# EAGLE design 7segement4digits1badidea-mk-5.0-smd (EAGLE 6.5.0)
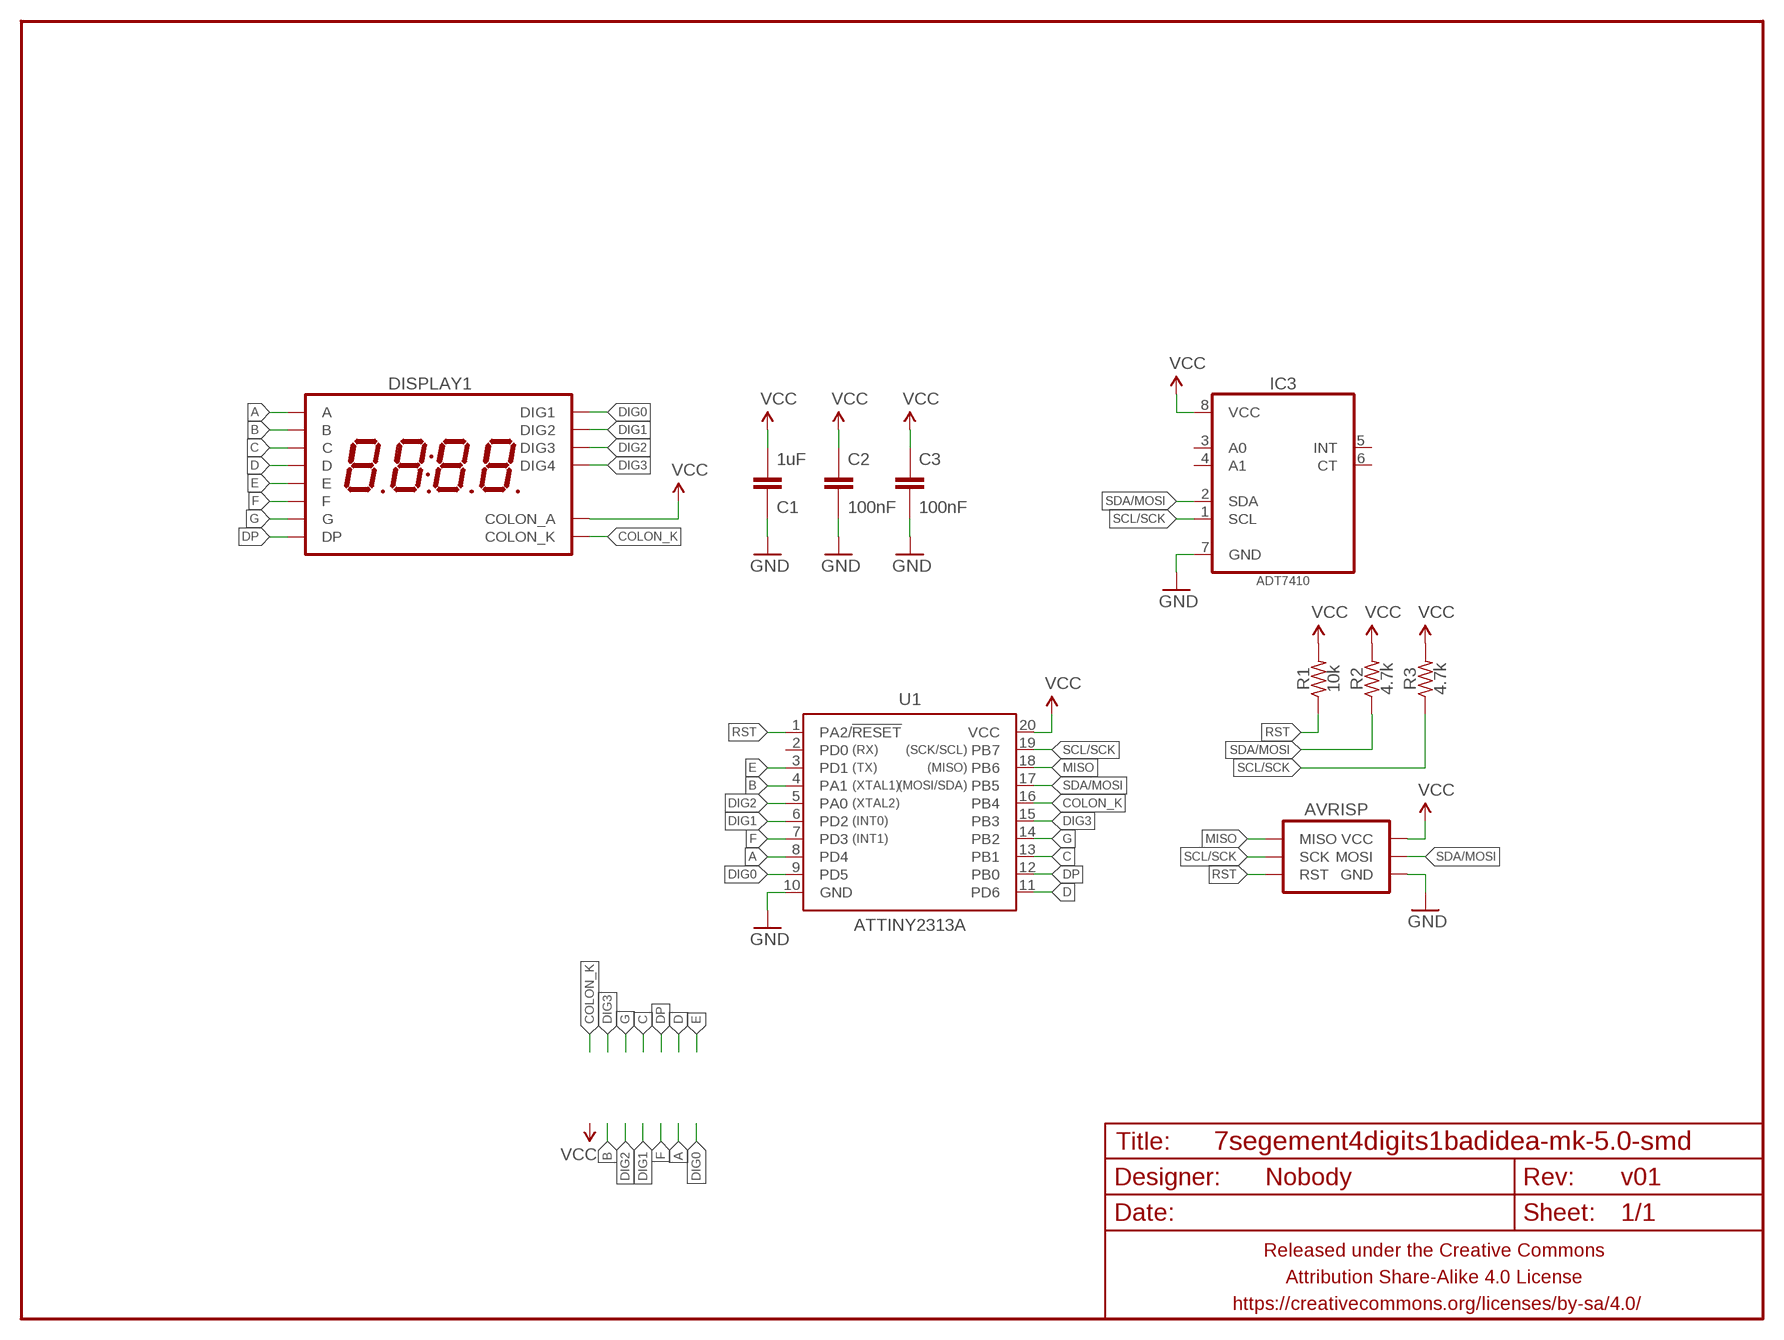
[diagram p0: schematic, sheet 1]

## Parts
AVRISP  AVR_SPI_PRG_6AVR-JST-PTH-RA-I2C  [AVR-JST-6-PTH-RA-I2C]
C1  1uF  CAPACITOR-CERAMICC0805  [C0805]
C2  100nF  CAPACITOR-CERAMICC0805  [C0805]
C3  100nF  CAPACITOR-CERAMICC0805  [C0805]
DISPLAY1  7SEG_4DIGIT_COLONADAFRUIT_0.56IN  [7SEG_4DIG]
FRAME1  FRAME-LETTERNO_PACKAGE  [DUMMY]
IC3  ADT7410  ADT7410TRZSOIC8N  [SOIC127P600X175-8N]
R1  10k  RESISTORR0805  [R0805]
R2  4.7k  RESISTORR0805  [R0805]
R3  4.7k  RESISTORR0805  [R0805]
U1  ATTINY2313A  ATTINY2313ASOIC-SLIM  [SOIC20W-SLIM]

## Nets
A: DISPLAY1.P$13(A) U1.8(PD4)
B: DISPLAY1.P$9(B) U1.4(PA1)
C: DISPLAY1.P$4(C) U1.13(PB1)
COLON_K: DISPLAY1.P$7(COLON_K) U1.16(PB4)
D: DISPLAY1.P$2(D) U1.11(PD6)
DIG0: DISPLAY1.P$14(DIG1) U1.9(PD5)
DIG1: DISPLAY1.P$11(DIG2) U1.6(PD2)
DIG2: DISPLAY1.P$10(DIG3) U1.5(PA0)
DIG3: DISPLAY1.P$6(DIG4) U1.15(PB3)
DP: DISPLAY1.P$3(DP) U1.12(PB0)
E: DISPLAY1.P$1(E) U1.3(PD1)
F: DISPLAY1.P$12(F) U1.7(PD3)
G: DISPLAY1.P$5(G) U1.14(PB2)
GND: AVRISP.GND C1.1 C2.2 C3.2 IC3.7(GND) U1.10(GND)
MISO: AVRISP.MISO U1.18(PB6)
RST: AVRISP.RESET(RST) R1.1 U1.1(PA2/!RESET)
SCL/SCK: AVRISP.SCK IC3.1(SCL) R3.1 U1.19(PB7)
SDA/MOSI: AVRISP.MOSI/SDA(MOSI) IC3.2(SDA) R2.1 U1.17(PB5)
VCC: AVRISP.VCC C1.2 C2.1 C3.1 DISPLAY1.P$8(COLON_A) IC3.8(VCC) R1.2 R2.2 R3.2 U1.20(VCC)
Unconnected: IC3.3(A0) IC3.4(A1) IC3.5(INT) IC3.6(CT) U1.2(PD0)

## Library data of the parts
AVRISP = A_butts:AVR_SPI_PRG_6: AVR ISP 6 Pin This is the reduced ISP connector for AVR programming. Common on Arduino. This footprint will take up less PCB space and can be used with a 10-pin to 6-pin adapter such as SKU: BOB-08508 **Special note about "TEST_POINT" package. The stop mask is on the top side, so if you want your programming test points to be on the bottom of your board, make sure to place this package on the bottom side of the board. This also ensure that the orientation to program from the bottom side will be correct.
C1-C3 = A_butts:CAPACITOR-CERAMIC: CAPACITOR, European symbol
DISPLAY1 = A_butts:7SEG_4DIGIT_COLON
FRAME1 = A_butts:FRAME-LETTER: Schematic Frame Standard 8.5x11 US Letter frame; DESIGNER: Nobody; VERSION: v01
IC3 = A_butts:ADT7410TRZ: I2C Temperature Sensor; MPN: ADT7410TRZ; OC_FARNELL: 2102534; OC_NEWARK: 08R6646; PACKAGE: SOIC-8; SUPPLIER: ANALOG DEVICES
R1-R3 = A_butts:RESISTOR: RESISTOR, American symbol
U1 = A_butts:ATTINY2313A: ATTINY2313A 2kB 20MHz I2C/SPI/UART

## Board
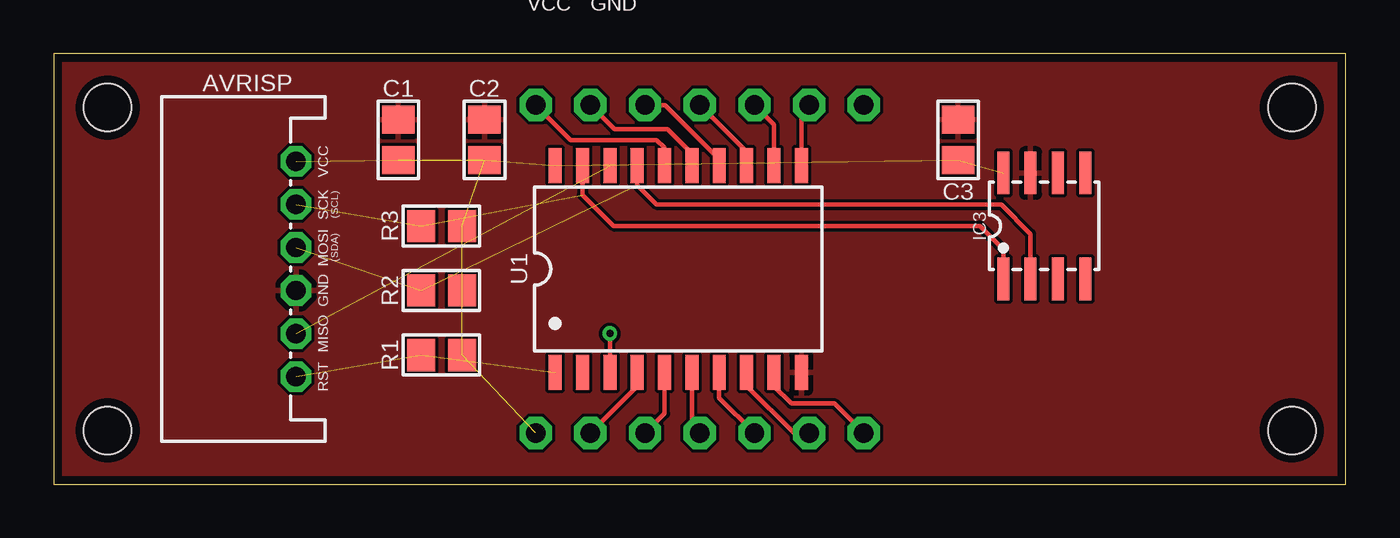
[diagram p1: board, top side]
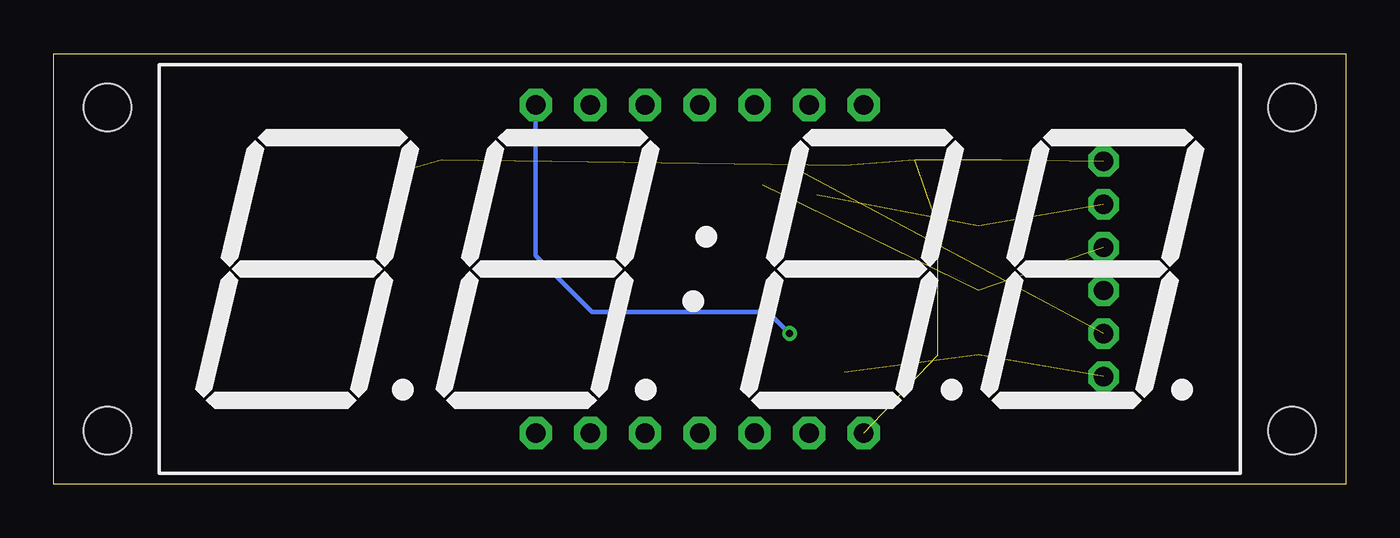
[diagram p2: board, bottom side, seen from below]

Size 60 x 20 mm. Coordinates in mm from the lower left corner, seen from the top.
Outline: 60,0 60,20 0,20 0,0 60,0
Copper layers (1*16): Top 0.0356mm / dielectric 1.5011mm / Bottom 0.0356mm
Design rules "LaenPCBOrder2": minimum track width 6mil, minimum drill 13mil, track to track 6mil, track to pad 6mil, pad to pad 6mil, via to via 6mil, smd to smd 6mil, copper to edge 15mil, drill to drill 6mil, minimum pad ring 7mil, minimum via ring 7mil, stop-mask expansion 3mil, vias tented up to drill 20mil, thermal gap 10mil
Holes 2.2 mm at 2.5,17.5 2.5,2.5 57.5,2.5 57.5,17.5

### Footprints (pad centres in the part's own frame; a part is rotated, then mirrored left to right if it is on the bottom)
AVR-JST-6-PTH-RA-I2C = drill 0.9 pad 1.422 octagon: GND -1,0; MISO -3,0; MOSI/SDA 1,0; RESET -5,0; SCK 3,0; VCC 5,0
C0805 = smd 1.3 x 1.5: 1 -0.95,0; 2 0.95,0
7SEG_4DIG = drill 0.9 pad 1.5 octagon: P$1 -7.62,7.62; P$2 -5.08,7.62; P$3 -2.54,7.62; P$4 0,7.62; P$5 2.54,7.62; P$6 5.08,7.62; P$7 7.62,7.62; P$8 7.62,-7.62; P$9 5.08,-7.62; P$10 2.54,-7.62; P$11 0,-7.62; P$12 -2.54,-7.62; P$13 -5.08,-7.62; P$14 -7.62,-7.62
SOIC127P600X175-8N = smd 1.981 x 0.559: 1 -2.464,1.905; 2 -2.464,0.635; 3 -2.464,-0.635; 4 -2.464,-1.905; 5 2.464,-1.905; 6 2.464,-0.635; 7 2.464,0.635; 8 2.464,1.905
R0805 = smd 1.3 x 1.5: 1 -0.95,0; 2 0.95,0
SOIC20W-SLIM = smd 0.6 x 1.63: 1 -5.715,-4.81; 2 -4.445,-4.81; 3 -3.175,-4.81; 4 -1.905,-4.81; 5 -0.635,-4.81; 6 0.635,-4.81; 7 1.905,-4.81; 8 3.175,-4.81; 9 4.445,-4.81; 10 5.715,-4.81; 11 5.715,4.81; 12 4.445,4.81; 13 3.175,4.81; 14 1.905,4.81; 15 0.635,4.81; 16 -0.635,4.81; 17 -1.905,4.81; 18 -3.175,4.81; 19 -4.445,4.81; 20 -5.715,4.81

### Placement (x,y rotation side)
AVRISP  11.25,10 90 top
C1  16,16 270 top
C2  20,16 90 top
C3  42,16 90 top
DISPLAY1  30,10 0 bottom
FRAME1  0,0 0 top
IC3  46,12 90 top
R1  18,6 0 top
R2  18,9 0 top
R3  18,12 0 top
U1  29,10 0 top

### Tracks (layer width: path | path; a pad name or v marks a point on that pad's centre or on a via)
A
  Top 0.2: DISPLAY1.P$13 34.37,2.38 32.17,4.58 U1.8
B
  Top 0.2: DISPLAY1.P$9 27.09,4.55 U1.4
C
  Top 0.2: DISPLAY1.P$4 32.17,15.45 U1.13
COLON_K
  Top 0.2: DISPLAY1.P$7 24,16 28,16 28.36,15.63 U1.16
D
  Top 0.2: DISPLAY1.P$2 34.72,17.25 U1.11
DIG0
  Top 0.2: U1.9 33.45,4.55 34.25,3.75 36.25,3.75 DISPLAY1.P$14
DIG1
  Top 0.2: DISPLAY1.P$11 29.64,2.75 U1.6
DIG2
  Top 0.2: DISPLAY1.P$10 28.36,3.29 U1.5
DIG3
  Top 0.2: DISPLAY1.P$6 26.04,16.5 28.5,16.5 29.64,15.37 U1.15
DP
  Top 0.2: DISPLAY1.P$3 33.45,16.71 U1.12
E  (via drill 0.33)
  Top 0.2: U1.3 v25.82,7
  Bottom 0.2: DISPLAY1.P$1 37.62,10.62 35,8 26.82,8 v25.82,7
F
  Top 0.2: DISPLAY1.P$12 30.91,4.01 U1.7
G
  Top 0.2: U1.14 30.91,15.1 28.38,17.62 DISPLAY1.P$5
GND
  pour Top: -0.1,20.1 60.1,20.1 60.1,-0.1 -0.1,-0.1
MISO  (1 unrouted)
RST  (2 unrouted)
SCL/SCK  (2 unrouted)
  Top 0.2: U1.19 24.55,13.45 26,12 43,12 44.09,10.9 IC3.1
SDA/MOSI  (2 unrouted)
  Top 0.2: U1.17 27.09,13.9 28,13 44,13 45.37,11.63 IC3.2
VCC  (9 unrouted)

### Text on the board
tPlace: VCC | GND